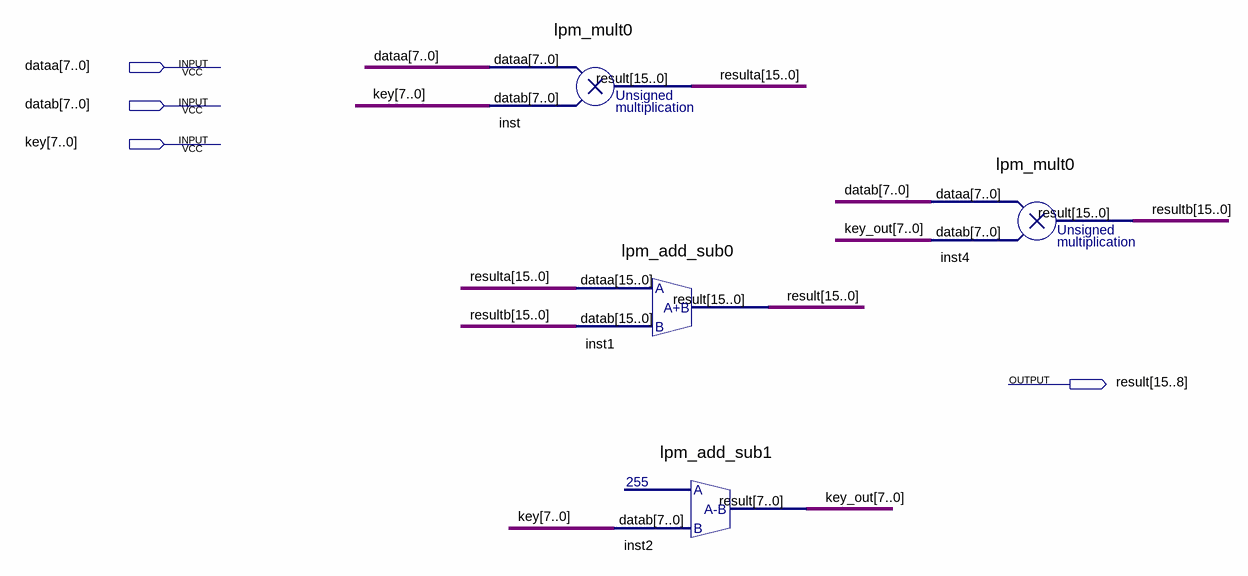
[diagram p0: schematic sheet]
// Quartus schematic anpha.bdf as structural Verilog: 4 symbols, 4 pins
module anpha (
  input  [7:0] dataa,
  input  [7:0] datab,
  input  [7:0] key,
  output [15:0] result
);

  wire [7:0] key_out;
  wire [15:0] resulta, resultb;

  lpm_mult0 inst (.dataa(dataa), .datab(key), .result(resulta));
  lpm_add_sub0 inst1 (.dataa(resulta), .datab(resultb), .result(result));
  lpm_add_sub1 inst2 (.datab(key), .result(key_out));
  lpm_mult0 inst4 (.dataa(datab), .datab(key_out), .result(resultb));
endmodule
